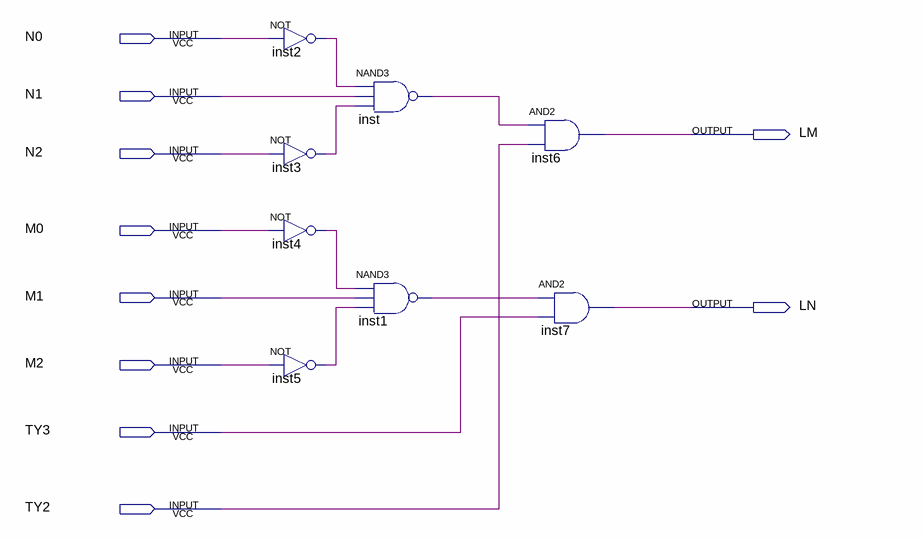
[diagram p0: schematic sheet]
// Quartus schematic LIGHT.bdf as structural Verilog: 8 symbols, 10 pins
module LIGHT (
  input  N0,
  input  N1,
  input  N2,
  input  M0,
  input  M1,
  input  M2,
  input  TY3,
  input  TY2,
  output LM,
  output LN
);

  wire inst1_out, inst2_out, inst3_out, inst4_out, inst5_out, inst_out;

  not inst2 (inst2_out, N0);
  not inst3 (inst3_out, N2);
  not inst4 (inst4_out, M0);
  not inst5 (inst5_out, M2);
  nand inst (inst_out, inst2_out, N1, inst3_out);
  nand inst1 (inst1_out, inst4_out, M1, inst5_out);
  and inst6 (LM, inst_out, TY2);
  and inst7 (LN, inst1_out, TY3);
endmodule
